# Altium schematic sheet power2pix_connector_v2.SchDoc
size A4
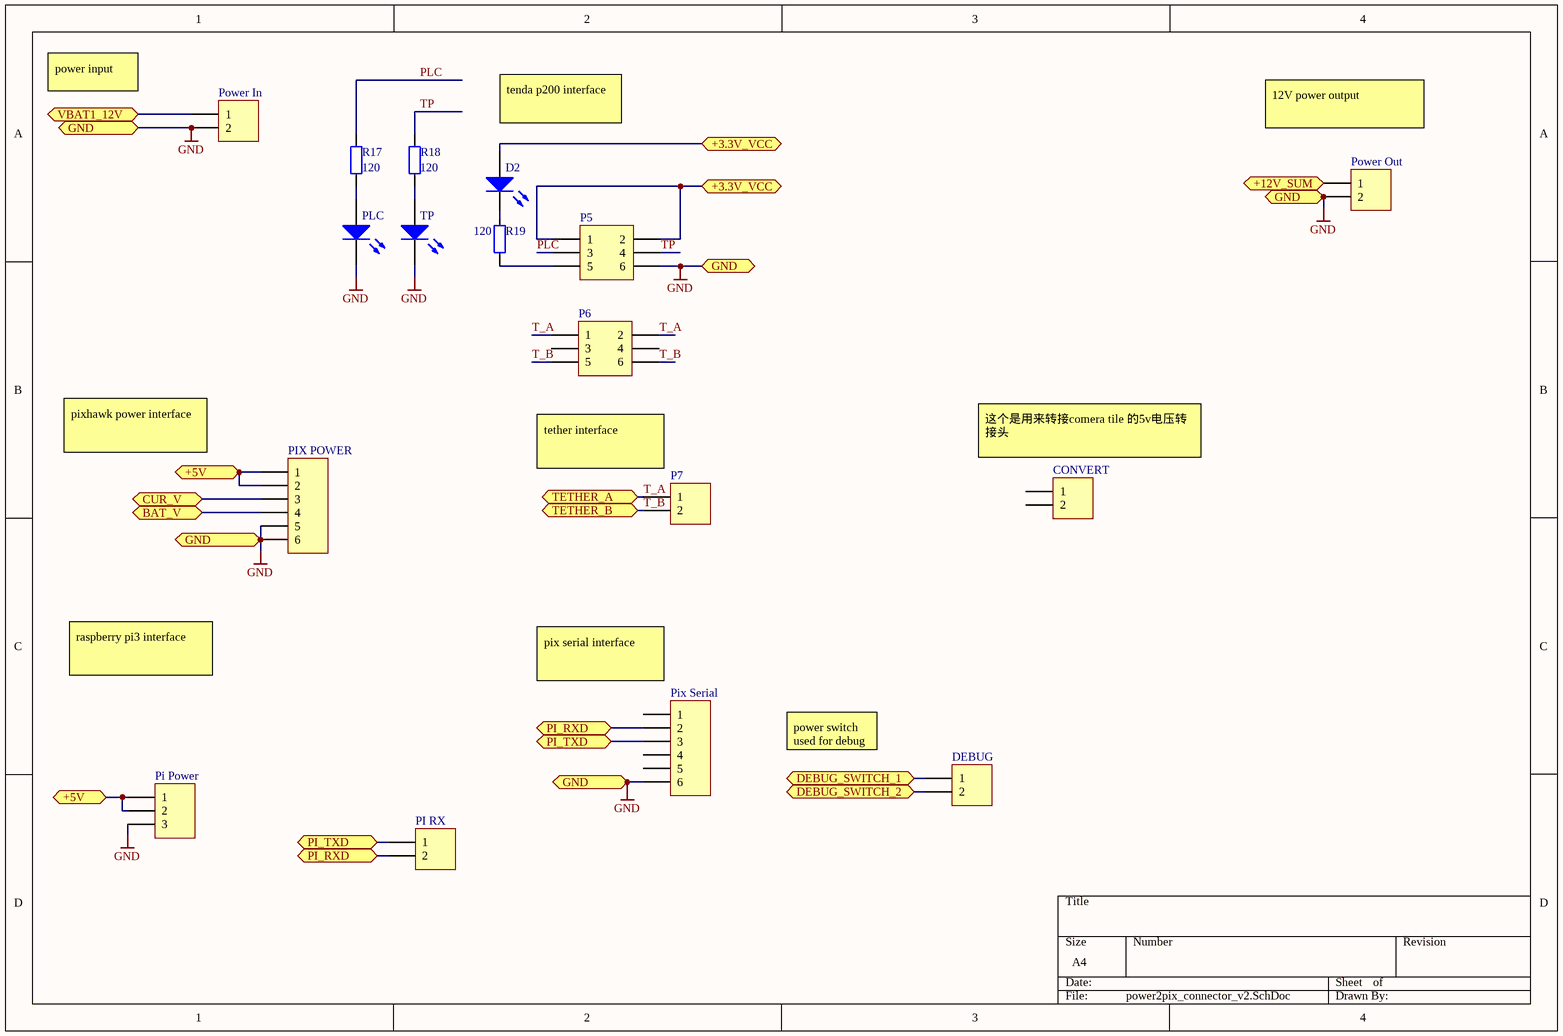
[diagram p0: power2pix_connector_v2.SchDoc]

## Parts
CONVERT  Header 2  [HDR1X2]  (value not drawn)
D2  LED0  [6-0805_M]  (value not drawn)
DEBUG  Header 2  [HDR1X2]  (value not drawn)
P5  Header 3X2  [HDR2X3]  (value not drawn)
P6  Header 3X2  [HDR2X3]  (value not drawn)
P7  Header 2  [ConnectorBlue]  (value not drawn)
Pi_Power  Header 3  [HDR1X3]  (value not drawn)
PI_RX  Header 2  [HDR1X2]  (value not drawn)
PIX_POWER  Header 6  [1.25_6PIN]  (value not drawn)
Pix_Serial  Header 6  [1.25_6PIN]  (value not drawn)
PLC  LED0  [6-0805_M]  (value not drawn)
Power_In  +  [1.25-4S]  (value not drawn)
Power_Out  +  [1.25-4S]  (value not drawn)
R17  value 120  [6-0805_M]  (hidden comment: Res2)
R18  value 120  [6-0805_M]  (hidden comment: Res2)
R19  value 120  [6-0805_M]  (hidden comment: Res2)
TP  LED0  [6-0805_M]  (value not drawn)

## Ports
+3.3V_VCC, +5V, +12V_SUM, BAT_V, CUR_V, DEBUG_SWITCH_1, DEBUG_SWITCH_2, GND, PI_RXD, PI_TXD, TETHER_A, TETHER_B, VBAT1_12V

## Nets
GND: P5.6 Pi_Power.3 PIX_POWER.5 PIX_POWER.6 Pix_Serial.6 PLC.2(K) Power_In.2 Power_Out.2 TP.2(K) ; port GND
+3.3V_VCC: D2.1(A) P5.1 P5.2 ; port +3.3V_VCC
+5V: Pi_Power.1 Pi_Power.2 PIX_POWER.1 PIX_POWER.2 ; port +5V
+12V_SUM: Power_Out.1 ; port +12V_SUM
BAT_V: PIX_POWER.4 ; port BAT_V
CUR_V: PIX_POWER.3 ; port CUR_V
DEBUG_SWITCH_1: DEBUG.1 ; port DEBUG_SWITCH_1
DEBUG_SWITCH_2: DEBUG.2 ; port DEBUG_SWITCH_2
PI_RXD: PI_RX.2 Pix_Serial.2 ; port PI_RXD
PI_TXD: PI_RX.1 Pix_Serial.3 ; port PI_TXD
PLC: P5.3 R17.2
T_A: P6.1 P6.2 P7.1 ; port TETHER_A
T_B: P6.5 P6.6 P7.2 ; port TETHER_B
TP: P5.4 R18.2
VBAT1_12V: Power_In.1 ; port VBAT1_12V
NetD2_2: D2.2(K) R19.2
NetP5_5: P5.5 R19.1
NetPLC_1: PLC.1(A) R17.1
NetR18_1: R18.1 TP.1(A)

Not connected (* = marked no-connect by the designer): CONVERT 1 2; P6 3 4; Pix_Serial 1 4 5

## Notes on the sheet
- power input
- tenda p200 interface
- 12V power output
- pixhawk power interface
- (near CONVERT) 这个是用来转接comera tile 的5v电压转接头
- (near P7) tether interface
- raspberry pi3 interface
- (near Pix_Serial) pix serial interface
- power switch used for debug

## Library data of the parts
CONVERT DEBUG P7 PI_RX Power_In Power_Out = Header 2: Header, 2-Pin; LatestRevisionDate: 17-Jul-2002; LatestRevisionNote: Re-released for DXP Platform.; Publisher: Altium Limited
D2 PLC TP = LED0: Typical INFRARED GaAs LED; Published: 8-Jun-2000; LatestRevisionDate: 08-Jul-2005; LatestRevisionNote: Mech Layer 1 removed.; PackageReference: LED-0; Publisher: Altium Limited; PackageDescription: LED; 2 Leads
P5 P6 = Header 3X2: Header, 3-Pin, Dual row; LatestRevisionDate: 17-Jul-2002; LatestRevisionNote: Re-released for DXP Platform.; Publisher: Altium Limited
Pi_Power = Header 3: Header, 3-Pin; LatestRevisionDate: 17-Jul-2002; LatestRevisionNote: Re-released for DXP Platform.; Publisher: Altium Limited
PIX_POWER Pix_Serial = Header 6: Header, 6-Pin; LatestRevisionDate: 17-Jul-2002; LatestRevisionNote: Re-released for DXP Platform.; Publisher: Altium Limited
R17-R19 = Res2: Resistor; Published: 8-Jun-2000; LatestRevisionDate: 17-Jul-2002; LatestRevisionNote: Re-released for DXP Platform.; PackageReference: AXIAL-0.4; Publisher: Altium Limited; PackageDescription: Axial Device, Thru-Hole; 2 Leads; 0.4 in Pin Spacing